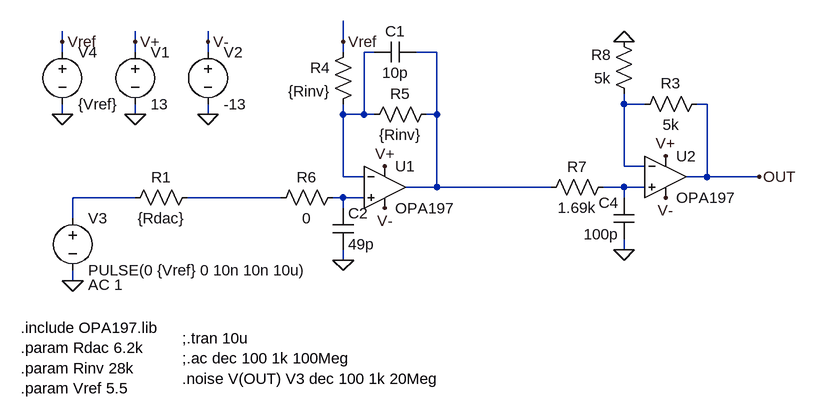
[diagram p0: schematic Noise estimate using DAC matched Rs.asc]
Noise estimate using DAC matched Rs.asc, the LTspice schematic file:
Version 4
SHEET 1 1260 680
WIRE 128 128 128 112
WIRE 240 128 240 112
WIRE 352 128 352 112
WIRE 560 128 560 96
WIRE 128 144 128 128
WIRE 240 144 240 128
WIRE 352 144 352 128
WIRE 560 144 560 128
WIRE 608 144 592 144
WIRE 704 144 672 144
WIRE 992 224 992 208
WIRE 1024 224 992 224
WIRE 1120 224 1104 224
WIRE 128 240 128 224
WIRE 240 240 240 224
WIRE 352 240 352 224
WIRE 560 240 560 224
WIRE 592 240 592 144
WIRE 592 240 560 240
WIRE 608 240 592 240
WIRE 704 240 704 144
WIRE 704 240 688 240
WIRE 992 320 992 224
WIRE 1024 320 992 320
WIRE 560 336 560 240
WIRE 592 336 560 336
WIRE 1120 336 1120 224
WIRE 1120 336 1088 336
WIRE 1200 336 1120 336
WIRE 704 352 704 240
WIRE 704 352 656 352
WIRE 880 352 704 352
WIRE 992 352 960 352
WIRE 1024 352 992 352
WIRE 240 368 144 368
WIRE 464 368 320 368
WIRE 560 368 544 368
WIRE 592 368 560 368
WIRE 992 368 992 352
WIRE 560 384 560 368
WIRE 144 400 144 368
WIRE 992 448 992 432
WIRE 560 464 560 448
WIRE 144 496 144 480
FLAG 240 240 0
FLAG 240 128 V+
FLAG 352 240 0
FLAG 352 128 V-
FLAG 624 320 V+
FLAG 624 384 V-
FLAG 144 496 0
FLAG 128 240 0
FLAG 128 128 Vref
FLAG 560 128 Vref
FLAG 560 464 0
FLAG 1056 304 V+
FLAG 1056 368 V-
FLAG 992 448 0
FLAG 1200 336 OUT
FLAG 992 128 0
SYMBOL Opamps/opamp2 624 288 R0
SYMATTR InstName U1
SYMATTR Value OPA197
SYMBOL voltage 240 128 R0
SYMATTR InstName V1
SYMATTR Value 13
SYMBOL voltage 352 128 R0
SYMATTR InstName V2
SYMATTR Value -13
SYMBOL voltage 144 384 R0
WINDOW 123 24 118 Left 2
SYMATTR Value2 AC 1
SYMATTR InstName V3
SYMATTR Value PULSE(0 {Vref} 0 10n 10n 10u)
SYMBOL res 336 352 R90
WINDOW 0 0 56 VBottom 2
WINDOW 3 32 56 VTop 2
SYMATTR InstName R1
SYMATTR Value {Rdac}
SYMBOL res 576 128 M0
SYMATTR InstName R4
SYMATTR Value {Rinv}
SYMBOL res 704 224 R90
WINDOW 0 0 56 VBottom 2
WINDOW 3 32 56 VTop 2
SYMATTR InstName R5
SYMATTR Value {Rinv}
SYMBOL voltage 128 128 R0
SYMATTR InstName V4
SYMATTR Value {Vref}
SYMBOL cap 544 384 R0
SYMATTR InstName C2
SYMATTR Value 49p
SYMBOL res 560 352 R90
WINDOW 0 0 56 VBottom 2
WINDOW 3 32 56 VTop 2
SYMATTR InstName R6
SYMATTR Value 0
SYMBOL cap 672 128 R90
WINDOW 0 0 32 VBottom 2
WINDOW 3 32 32 VTop 2
SYMATTR InstName C1
SYMATTR Value 10p
SYMBOL res 976 336 R90
WINDOW 0 0 56 VBottom 2
WINDOW 3 32 56 VTop 2
SYMATTR InstName R7
SYMATTR Value 1.69k
SYMBOL Opamps/opamp2 1056 272 R0
SYMATTR InstName U2
SYMATTR Value OPA197
SYMBOL cap 1008 432 R180
WINDOW 0 24 56 Left 2
WINDOW 3 24 8 Left 2
SYMATTR InstName C4
SYMATTR Value 100p
SYMBOL res 1120 208 R90
WINDOW 0 0 56 VBottom 2
WINDOW 3 32 56 VTop 2
SYMATTR InstName R3
SYMATTR Value 5k
SYMBOL res 1008 224 R180
WINDOW 0 36 76 Left 2
WINDOW 3 36 40 Left 2
SYMATTR InstName R8
SYMATTR Value 5k
TEXT 64 568 Left 2 !.include OPA197.lib\n.param Rdac 6.2k\n.param Rinv 28k\n.param Vref 5.5
TEXT 312 584 Left 2 !;.tran 10u\n;.ac dec 100 1k 100Meg\n.noise V(OUT) V3 dec 100 1k 20Meg

The netlist it stands for:
* Noise estimate using DAC matched Rs.asc
XU1 N007 N001 V+ V- N002 OPA197  ; pins In+ In- V+ V- OUT
V1 V+ 0 13
V2 V- 0 -13
V3 N005 0 PULSE(0 {Vref} 0 10n 10n 10u) AC 1
R1 N006 N005 {Rdac}
R4 Vref N001 {Rinv}
R5 N002 N001 {Rinv}
V4 Vref 0 {Vref}
C2 N007 0 49p
R6 N007 N006 0
C1 N002 N001 10p
R7 N004 N002 1.69k
XU2 N004 N003 V+ V- OUT OPA197  ; pins In+ In- V+ V- OUT
C4 0 N004 100p
R3 OUT N003 5k
R8 N003 0 5k
.include OPA197.lib
.param Rdac 6.2k
.param Rinv 28k
.param Vref 5.5
;.tran 10u
;.ac dec 100 1k 100Meg
.noise V(OUT) V3 dec 100 1k 20Meg
.backanno
.end